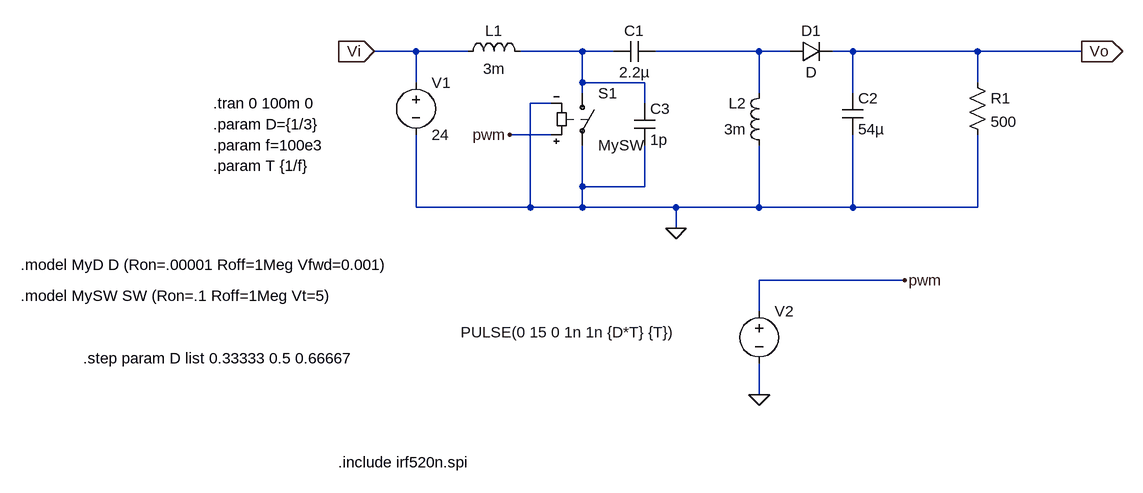
[diagram p0: schematic Draft4.asc]
Draft4.asc, the LTspice schematic file:
Version 4
SHEET 1 880 1048
WIRE -448 -80 -512 -80
WIRE -368 -80 -448 -80
WIRE -192 -80 -288 -80
WIRE -144 -80 -192 -80
WIRE 80 -80 -80 -80
WIRE 128 -80 80 -80
WIRE 224 -80 192 -80
WIRE 416 -80 224 -80
WIRE 576 -80 416 -80
WIRE -448 -32 -448 -80
WIRE -192 -32 -192 -80
WIRE -96 -32 -192 -32
WIRE 416 -32 416 -80
WIRE -192 -16 -192 -32
WIRE 80 -16 80 -80
WIRE 224 -16 224 -80
WIRE -240 0 -272 0
WIRE -96 0 -96 -32
WIRE -240 48 -304 48
WIRE -192 128 -192 64
WIRE -96 128 -96 64
WIRE -96 128 -192 128
WIRE -448 160 -448 48
WIRE -272 160 -272 0
WIRE -272 160 -448 160
WIRE -192 160 -192 128
WIRE -192 160 -272 160
WIRE -48 160 -192 160
WIRE 80 160 80 64
WIRE 80 160 -48 160
WIRE 224 160 224 48
WIRE 224 160 80 160
WIRE 416 160 416 48
WIRE 416 160 224 160
WIRE -48 192 -48 160
WIRE 304 272 80 272
WIRE 80 320 80 272
WIRE 80 448 80 400
FLAG -48 192 0
FLAG -304 48 pwm
FLAG 576 -80 Vo
IOPIN 576 -80 Out
FLAG 80 448 0
FLAG 304 272 pwm
FLAG -512 -80 Vi
IOPIN -512 -80 In
SYMBOL cap -144 -64 R270
WINDOW 0 32 32 VTop 2
WINDOW 3 0 32 VBottom 2
SYMATTR InstName C1
SYMATTR Value 2.2µ
SYMBOL cap 208 -16 R0
SYMATTR InstName C2
SYMATTR Value 54µ
SYMATTR SpiceLine Rser=0.3
SYMBOL res 400 -48 R0
SYMATTR InstName R1
SYMATTR Value 500
SYMBOL voltage -448 -48 R0
WINDOW 123 0 0 Left 0
WINDOW 39 0 0 Left 0
SYMATTR InstName V1
SYMATTR Value 24
SYMBOL voltage 80 304 R0
WINDOW 3 -459 48 Left 2
WINDOW 123 0 0 Left 0
WINDOW 39 0 0 Left 0
SYMATTR Value PULSE(0 15 0 1n 1n {D*T} {T})
SYMATTR InstName V2
SYMBOL ind -384 -64 R270
WINDOW 0 32 56 VTop 2
WINDOW 3 5 56 VBottom 2
SYMATTR InstName L1
SYMATTR Value 3m
SYMATTR SpiceLine Rser=1
SYMBOL ind 96 80 R180
WINDOW 0 36 80 Left 2
WINDOW 3 36 40 Left 2
SYMATTR InstName L2
SYMATTR Value 3m
SYMATTR SpiceLine Rser=1
SYMBOL diode 128 -64 R270
WINDOW 0 32 32 VTop 2
WINDOW 3 0 32 VBottom 2
SYMATTR InstName D1
SYMBOL sw -192 -32 R0
SYMATTR InstName S1
SYMATTR Value MySW
SYMBOL cap -112 0 R0
SYMATTR InstName C3
SYMATTR Value 1p
TEXT -760 0 Left 2 !.tran 0 100m 0
TEXT -760 32 Left 2 !.param D={1/3}
TEXT -760 64 Left 2 !.param f=100e3
TEXT -760 96 Left 2 !.param T {1/f}
TEXT -1056 248 Left 2 !.model MyD D (Ron=.00001 Roff=1Meg Vfwd=0.001)
TEXT -1056 296 Left 2 !.model MySW SW (Ron=.1 Roff=1Meg Vt=5)
TEXT -568 552 Left 2 !.include irf520n.spi
TEXT -960 392 Left 2 !.step param D list 0.33333 0.5 0.66667

The netlist it stands for:
* Draft4.asc
C1 N001 N002 2.2µ
C2 Vo 0 54µ Rser=0.3
R1 Vo 0 500
V1 Vi 0 24
V2 pwm 0 PULSE(0 15 0 1n 1n {D*T} {T})
L1 Vi N001 3m Rser=1
L2 0 N002 3m Rser=1
D1 N002 Vo D
S1 N001 0 pwm 0 MySW
C3 N001 0 1p
.model D D
.lib standard.dio
.tran 0 100m 0
.param D={1/3}
.param f=100e3
.param T {1/f}
.model MyD D (Ron=.00001 Roff=1Meg Vfwd=0.001)
.model MySW SW (Ron=.1 Roff=1Meg Vt=5)
.include irf520n.spi
.step param D list 0.33333 0.5 0.66667
.backanno
.end